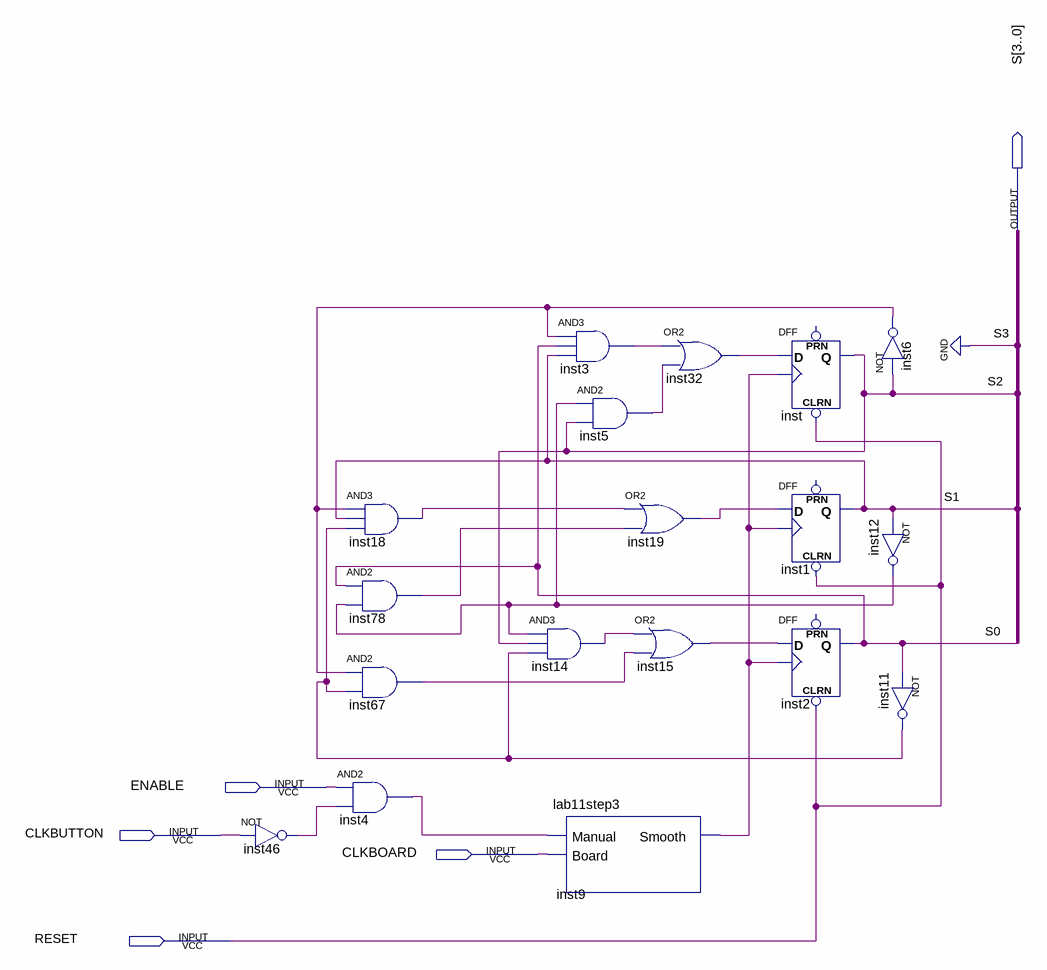
[diagram p0: schematic sheet]
// Quartus schematic modulo8counter.bdf as structural Verilog: 18 symbols, 5 pins
module modulo8counter (
  input  ENABLE,
  input  CLKBUTTON,
  input  CLKBOARD,
  input  RESET,
  output [3:0] S
);

  wire inst3_out, inst4_out, inst5_out, inst6_out, inst9_smooth, inst11_out, inst12_out, inst14_out,
       inst15_out, inst18_out, inst19_out, inst32_out, inst46_out, inst67_out, inst78_out;

  not inst46 (inst46_out, CLKBUTTON);
  and inst4 (inst4_out, ENABLE, inst46_out);
  and inst18 (inst18_out, inst6_out, S[1], inst11_out);
  and inst78 (inst78_out, S[0], inst12_out);
  and inst67 (inst67_out, inst6_out, inst11_out);
  and inst3 (inst3_out, inst6_out, S[0], S[1]);
  and inst14 (inst14_out, inst12_out, S[2], inst11_out);
  lab11step3 inst9 (.Manual(inst4_out), .Board(CLKBOARD), .Smooth(inst9_smooth));
  and inst5 (inst5_out, inst12_out, S[2]);
  or inst19 (inst19_out, inst18_out, inst78_out);
  or inst15 (inst15_out, inst14_out, inst67_out);
  or inst32 (inst32_out, inst3_out, inst5_out);
  DFF inst (.CLRN(RESET), .CLK(inst9_smooth), .D(inst32_out), .Q(S[2]));  // open: PRN
  DFF inst1 (.CLRN(RESET), .CLK(inst9_smooth), .D(inst19_out), .Q(S[1]));  // open: PRN
  DFF inst2 (.CLRN(RESET), .CLK(inst9_smooth), .D(inst15_out), .Q(S[0]));  // open: PRN
  not inst6 (inst6_out, S[2]);
  not inst12 (inst12_out, S[1]);
  not inst11 (inst11_out, S[0]);

  assign S[3] = 1'b0;
endmodule
